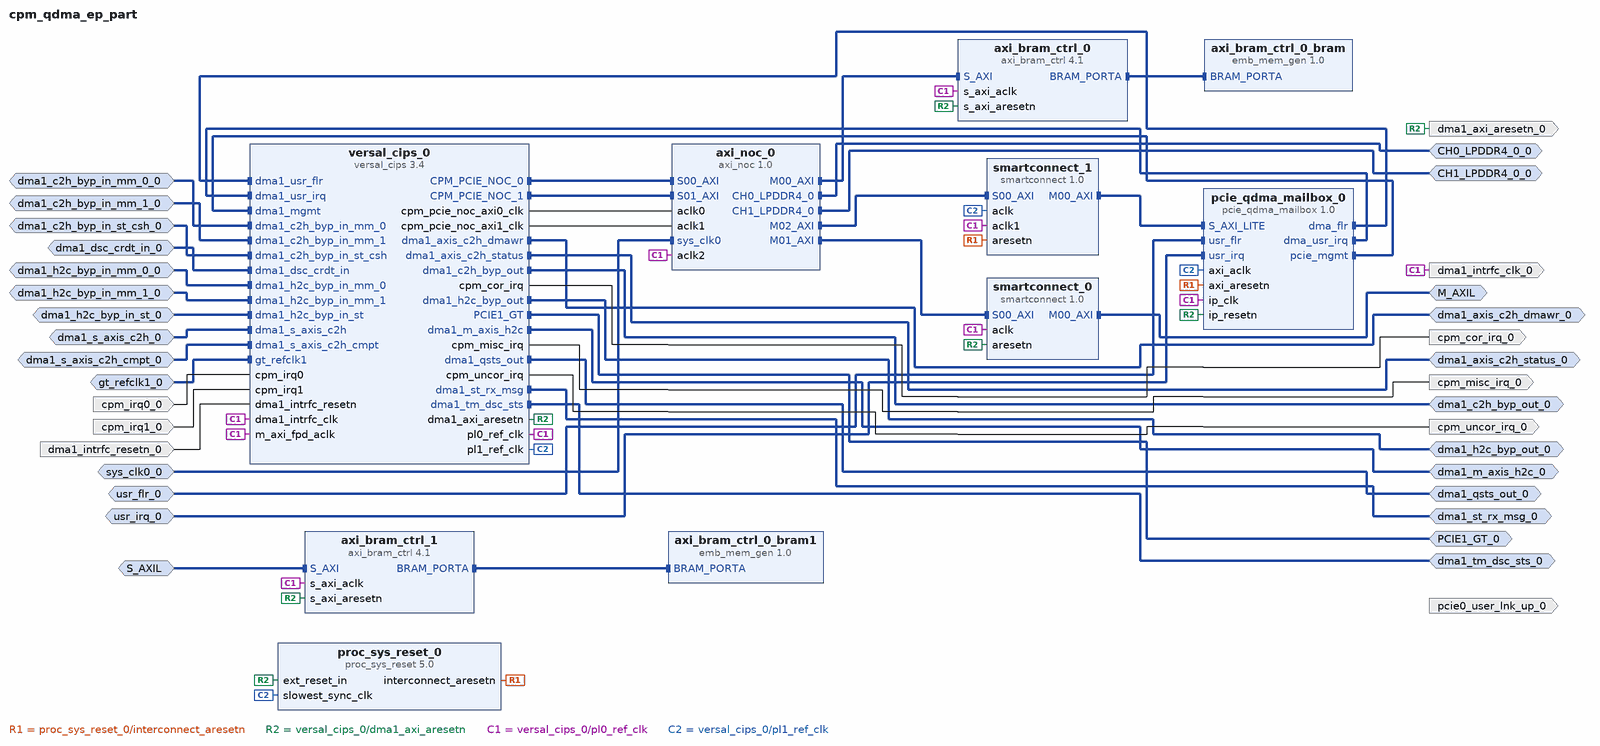
[diagram p0: block diagram of the top level]
# Vivado block design cpm_qdma_ep_part, xcvp1202-vsva2785-3HP-e-S, Vivado 2023.2
create_bd_design cpm_qdma_ep_part

create_bd_intf_port -mode Master -vlnv xilinx.com:interface:lpddr4_rtl:1.0 CH0_LPDDR4_0_0
create_bd_intf_port -mode Master -vlnv xilinx.com:interface:lpddr4_rtl:1.0 CH1_LPDDR4_0_0
create_bd_intf_port -mode Master -vlnv xilinx.com:interface:aximm_rtl:1.0 M_AXIL
set_property -dict [list \
  CONFIG.ADDR_WIDTH 42 \
  CONFIG.DATA_WIDTH 32 \
  CONFIG.HAS_BURST 0 \
  CONFIG.HAS_CACHE 0 \
  CONFIG.HAS_LOCK 0 \
  CONFIG.HAS_PROT 1 \
  CONFIG.HAS_QOS 0 \
  CONFIG.HAS_REGION 0 \
  CONFIG.PROTOCOL AXI4LITE \
] [get_bd_intf_ports M_AXIL]
create_bd_intf_port -mode Master -vlnv xilinx.com:interface:gt_rtl:1.0 PCIE1_GT_0
create_bd_intf_port -mode Slave -vlnv xilinx.com:interface:aximm_rtl:1.0 S_AXIL
set_property -dict [list \
  CONFIG.ADDR_WIDTH 15 \
  CONFIG.ARUSER_WIDTH 0 \
  CONFIG.AWUSER_WIDTH 0 \
  CONFIG.BUSER_WIDTH 0 \
  CONFIG.DATA_WIDTH 32 \
  CONFIG.HAS_BRESP 1 \
  CONFIG.HAS_BURST 0 \
  CONFIG.HAS_CACHE 0 \
  CONFIG.HAS_LOCK 0 \
  CONFIG.HAS_PROT 1 \
  CONFIG.HAS_QOS 0 \
  CONFIG.HAS_REGION 0 \
  CONFIG.HAS_RRESP 1 \
  CONFIG.HAS_WSTRB 1 \
  CONFIG.ID_WIDTH 0 \
  CONFIG.MAX_BURST_LENGTH 1 \
  CONFIG.NUM_READ_OUTSTANDING 1 \
  CONFIG.NUM_READ_THREADS 1 \
  CONFIG.NUM_WRITE_OUTSTANDING 1 \
  CONFIG.NUM_WRITE_THREADS 1 \
  CONFIG.PROTOCOL AXI4LITE \
  CONFIG.READ_WRITE_MODE READ_WRITE \
  CONFIG.RUSER_BITS_PER_BYTE 0 \
  CONFIG.RUSER_WIDTH 0 \
  CONFIG.SUPPORTS_NARROW_BURST 0 \
  CONFIG.WUSER_BITS_PER_BYTE 0 \
  CONFIG.WUSER_WIDTH 0 \
] [get_bd_intf_ports S_AXIL]
create_bd_intf_port -mode Master -vlnv xilinx.com:display_eqdma:axis_c2h_dmawr_rtl:1.0 dma1_axis_c2h_dmawr_0
create_bd_intf_port -mode Master -vlnv xilinx.com:interface:qdma_c2h_status_rtl:1.0 dma1_axis_c2h_status_0
create_bd_intf_port -mode Slave -vlnv xilinx.com:interface:qdma_dsc_byp_rtl:1.0 dma1_c2h_byp_in_mm_0_0
create_bd_intf_port -mode Slave -vlnv xilinx.com:interface:qdma_dsc_byp_rtl:1.0 dma1_c2h_byp_in_mm_1_0
create_bd_intf_port -mode Slave -vlnv xilinx.com:interface:qdma_dsc_byp_rtl:1.0 dma1_c2h_byp_in_st_csh_0
create_bd_intf_port -mode Master -vlnv xilinx.com:interface:qdma_dsc_byp_rtl:1.0 dma1_c2h_byp_out_0
create_bd_intf_port -mode Slave -vlnv xilinx.com:interface:qdma_dsc_crdt_in_rtl:1.0 dma1_dsc_crdt_in_0
create_bd_intf_port -mode Slave -vlnv xilinx.com:interface:qdma_dsc_byp_rtl:1.0 dma1_h2c_byp_in_mm_0_0
create_bd_intf_port -mode Slave -vlnv xilinx.com:interface:qdma_dsc_byp_rtl:1.0 dma1_h2c_byp_in_mm_1_0
create_bd_intf_port -mode Slave -vlnv xilinx.com:interface:qdma_dsc_byp_rtl:1.0 dma1_h2c_byp_in_st_0
create_bd_intf_port -mode Master -vlnv xilinx.com:interface:qdma_dsc_byp_rtl:1.0 dma1_h2c_byp_out_0
create_bd_intf_port -mode Master -vlnv xilinx.com:display_eqdma:m_axis_h2c_rtl:1.0 dma1_m_axis_h2c_0
create_bd_intf_port -mode Master -vlnv xilinx.com:interface:eqdma_qsts_rtl:1.0 dma1_qsts_out_0
create_bd_intf_port -mode Slave -vlnv xilinx.com:display_eqdma:s_axis_c2h_rtl:1.0 dma1_s_axis_c2h_0
create_bd_intf_port -mode Slave -vlnv xilinx.com:display_eqdma:s_axis_c2h_cmpt_rtl:1.0 dma1_s_axis_c2h_cmpt_0
create_bd_intf_port -mode Master -vlnv xilinx.com:interface:axis_rtl:1.0 dma1_st_rx_msg_0
create_bd_intf_port -mode Master -vlnv xilinx.com:interface:qdma_tm_dsc_sts_rtl:1.0 dma1_tm_dsc_sts_0
create_bd_intf_port -mode Slave -vlnv xilinx.com:interface:diff_clock_rtl:1.0 gt_refclk1_0
create_bd_intf_port -mode Slave -vlnv xilinx.com:interface:diff_clock_rtl:1.0 sys_clk0_0
set_property -dict {CONFIG.FREQ_HZ 200000000} [get_bd_intf_ports sys_clk0_0]
create_bd_intf_port -mode Slave -vlnv xilinx.com:interface:qdma_usr_irq_rtl:1.0 usr_irq_0
create_bd_intf_port -mode Slave -vlnv xilinx.com:display_eqdma:usr_flr_rtl:1.0 usr_flr_0
create_bd_port -dir O -type intr cpm_cor_irq_0
create_bd_port -dir I -type intr cpm_irq0_0
create_bd_port -dir I -type intr cpm_irq1_0
create_bd_port -dir O -type intr cpm_misc_irq_0
create_bd_port -dir O -type intr cpm_uncor_irq_0
create_bd_port -dir O -type rst dma1_axi_aresetn_0
create_bd_port -dir O -type clk dma1_intrfc_clk_0
set_property -dict [list \
  CONFIG.ASSOCIATED_BUSIF S_AXIL:M_AXIL:dma1_st_rx_msg_0 \
  CONFIG.ASSOCIATED_RESET dma1_axi_aresetn_0 \
] [get_bd_ports dma1_intrfc_clk_0]
create_bd_port -dir I -type rst dma1_intrfc_resetn_0
create_bd_port -dir O pcie0_user_lnk_up_0

create_bd_cell -type ip -vlnv xilinx.com:ip:axi_bram_ctrl:4.1 axi_bram_ctrl_0
set_property -dict {CONFIG.DATA_WIDTH 512 CONFIG.SINGLE_PORT_BRAM 1} [get_bd_cells axi_bram_ctrl_0]
create_bd_cell -type ip -vlnv xilinx.com:ip:emb_mem_gen:1.0 axi_bram_ctrl_0_bram1
set_property -dict {CONFIG.ADDR_WIDTH_A 12 CONFIG.ADDR_WIDTH_B 12} [get_bd_cells axi_bram_ctrl_0_bram1]
create_bd_cell -type ip -vlnv xilinx.com:ip:emb_mem_gen:1.0 axi_bram_ctrl_0_bram
set_property -dict [list \
  CONFIG.ADDR_WIDTH_A 12 \
  CONFIG.ADDR_WIDTH_B 12 \
  CONFIG.READ_DATA_WIDTH_B 512 \
  CONFIG.WRITE_DATA_WIDTH_B 512 \
] [get_bd_cells axi_bram_ctrl_0_bram]
create_bd_cell -type ip -vlnv xilinx.com:ip:axi_bram_ctrl:4.1 axi_bram_ctrl_1
set_property -dict {CONFIG.PROTOCOL AXI4LITE CONFIG.SINGLE_PORT_BRAM 1} [get_bd_cells axi_bram_ctrl_1]
create_bd_cell -type ip -vlnv xilinx.com:ip:axi_noc:1.0 axi_noc_0
set_property -dict [list \
  CONFIG.CONTROLLERTYPE LPDDR4_SDRAM \
  CONFIG.MC0_CONFIG_NUM config26 \
  CONFIG.MC0_FLIPPED_PINOUT true \
  CONFIG.MC1_CONFIG_NUM config26 \
  CONFIG.MC2_CONFIG_NUM config26 \
  CONFIG.MC3_CONFIG_NUM config26 \
  CONFIG.MC_ADDR_WIDTH 6 \
  CONFIG.MC_BURST_LENGTH 16 \
  CONFIG.MC_CASLATENCY 28 \
  CONFIG.MC_CASWRITELATENCY 14 \
  CONFIG.MC_CH0_LP4_CHA_ENABLE true \
  CONFIG.MC_CH0_LP4_CHB_ENABLE true \
  CONFIG.MC_CH1_LP4_CHA_ENABLE true \
  CONFIG.MC_CH1_LP4_CHB_ENABLE true \
  CONFIG.MC_CHAN_REGION1 DDR_LOW1 \
  CONFIG.MC_CKE_WIDTH 0 \
  CONFIG.MC_CK_WIDTH 0 \
  CONFIG.MC_COMPONENT_DENSITY 16Gb \
  CONFIG.MC_COMPONENT_WIDTH x32 \
  CONFIG.MC_CONFIG_NUM config26 \
  CONFIG.MC_DATAWIDTH 32 \
  CONFIG.MC_DM_WIDTH 4 \
  CONFIG.MC_DQS_WIDTH 4 \
  CONFIG.MC_DQ_WIDTH 32 \
  CONFIG.MC_ECC false \
  CONFIG.MC_ECC_SCRUB_SIZE 4096 \
  CONFIG.MC_F1_CASLATENCY 28 \
  CONFIG.MC_F1_CASWRITELATENCY 14 \
  CONFIG.MC_F1_LPDDR4_MR1 0x0000 \
  CONFIG.MC_F1_LPDDR4_MR2 0x0000 \
  CONFIG.MC_F1_LPDDR4_MR3 0x0000 \
  CONFIG.MC_F1_LPDDR4_MR11 0x0000 \
  CONFIG.MC_F1_LPDDR4_MR13 0x00C0 \
  CONFIG.MC_F1_LPDDR4_MR22 0x0000 \
  CONFIG.MC_F1_TCCD_L 0 \
  CONFIG.MC_F1_TCCD_L_MIN 0 \
  CONFIG.MC_F1_TFAW 40000 \
  CONFIG.MC_F1_TFAWMIN 40000 \
  CONFIG.MC_F1_TMOD 0 \
  CONFIG.MC_F1_TMOD_MIN 0 \
  CONFIG.MC_F1_TMRD 14000 \
  CONFIG.MC_F1_TMRDMIN 14000 \
  CONFIG.MC_F1_TMRW 10000 \
  CONFIG.MC_F1_TMRWMIN 10000 \
  CONFIG.MC_F1_TRAS 42000 \
  CONFIG.MC_F1_TRASMIN 42000 \
  CONFIG.MC_F1_TRCD 18000 \
  CONFIG.MC_F1_TRCDMIN 18000 \
  CONFIG.MC_F1_TRPAB 21000 \
  CONFIG.MC_F1_TRPABMIN 21000 \
  CONFIG.MC_F1_TRPPB 18000 \
  CONFIG.MC_F1_TRPPBMIN 18000 \
  CONFIG.MC_F1_TRRD 10000 \
  CONFIG.MC_F1_TRRDMIN 10000 \
  CONFIG.MC_F1_TRRD_L 0 \
  CONFIG.MC_F1_TRRD_L_MIN 0 \
  CONFIG.MC_F1_TRRD_S 0 \
  CONFIG.MC_F1_TRRD_S_MIN 0 \
  CONFIG.MC_F1_TWR 18000 \
  CONFIG.MC_F1_TWRMIN 18000 \
  CONFIG.MC_F1_TWTR 10000 \
  CONFIG.MC_F1_TWTRMIN 10000 \
  CONFIG.MC_F1_TWTR_L 0 \
  CONFIG.MC_F1_TWTR_L_MIN 0 \
  CONFIG.MC_F1_TWTR_S 0 \
  CONFIG.MC_F1_TWTR_S_MIN 0 \
  CONFIG.MC_F1_TZQLAT 30000 \
  CONFIG.MC_F1_TZQLATMIN 30000 \
  CONFIG.MC_INPUTCLK0_PERIOD 5000 \
  CONFIG.MC_LP4_CA_A_WIDTH 6 \
  CONFIG.MC_LP4_CA_B_WIDTH 6 \
  CONFIG.MC_LP4_CKE_A_WIDTH 1 \
  CONFIG.MC_LP4_CKE_B_WIDTH 1 \
  CONFIG.MC_LP4_CKT_A_WIDTH 1 \
  CONFIG.MC_LP4_CKT_B_WIDTH 1 \
  CONFIG.MC_LP4_CS_A_WIDTH 1 \
  CONFIG.MC_LP4_CS_B_WIDTH 1 \
  CONFIG.MC_LP4_DMI_A_WIDTH 2 \
  CONFIG.MC_LP4_DMI_B_WIDTH 2 \
  CONFIG.MC_LP4_DQS_A_WIDTH 2 \
  CONFIG.MC_LP4_DQS_B_WIDTH 2 \
  CONFIG.MC_LP4_DQ_A_WIDTH 16 \
  CONFIG.MC_LP4_DQ_B_WIDTH 16 \
  CONFIG.MC_LP4_RESETN_WIDTH 1 \
  CONFIG.MC_MEMORY_SPEEDGRADE LPDDR4X-3200 \
  CONFIG.MC_MEMORY_TIMEPERIOD0 625 \
  CONFIG.MC_NETLIST_SIMULATION true \
  CONFIG.MC_NO_CHANNELS Dual \
  CONFIG.MC_ODTLon 6 \
  CONFIG.MC_ODT_WIDTH 0 \
  CONFIG.MC_PER_RD_INTVL 0 \
  CONFIG.MC_PRE_DEF_ADDR_MAP_SEL ROW_BANK_COLUMN \
  CONFIG.MC_TCCD 8 \
  CONFIG.MC_TCCD_L 0 \
  CONFIG.MC_TCCD_L_MIN 0 \
  CONFIG.MC_TCKE 12 \
  CONFIG.MC_TCKEMIN 12 \
  CONFIG.MC_TDQS2DQ_MAX 800 \
  CONFIG.MC_TDQS2DQ_MIN 200 \
  CONFIG.MC_TDQSCK_MAX 3500 \
  CONFIG.MC_TFAW 40000 \
  CONFIG.MC_TFAWMIN 40000 \
  CONFIG.MC_TMOD 0 \
  CONFIG.MC_TMOD_MIN 0 \
  CONFIG.MC_TMRD 14000 \
  CONFIG.MC_TMRDMIN 14000 \
  CONFIG.MC_TMRD_div4 10 \
  CONFIG.MC_TMRD_nCK 23 \
  CONFIG.MC_TMRW 10000 \
  CONFIG.MC_TMRWMIN 10000 \
  CONFIG.MC_TMRW_div4 10 \
  CONFIG.MC_TMRW_nCK 16 \
  CONFIG.MC_TODTon_MIN 3 \
  CONFIG.MC_TOSCO 40000 \
  CONFIG.MC_TOSCOMIN 40000 \
  CONFIG.MC_TOSCO_nCK 64 \
  CONFIG.MC_TPBR2PBR 90000 \
  CONFIG.MC_TPBR2PBRMIN 90000 \
  CONFIG.MC_TRAS 42000 \
  CONFIG.MC_TRASMIN 42000 \
  CONFIG.MC_TRAS_nCK 68 \
  CONFIG.MC_TRC 63000 \
  CONFIG.MC_TRCD 18000 \
  CONFIG.MC_TRCDMIN 18000 \
  CONFIG.MC_TRCD_nCK 29 \
  CONFIG.MC_TRCMIN 0 \
  CONFIG.MC_TREFI 3904000 \
  CONFIG.MC_TREFIPB 488000 \
  CONFIG.MC_TRFC 0 \
  CONFIG.MC_TRFCAB 280000 \
  CONFIG.MC_TRFCABMIN 280000 \
  CONFIG.MC_TRFCMIN 0 \
  CONFIG.MC_TRFCPB 140000 \
  CONFIG.MC_TRFCPBMIN 140000 \
  CONFIG.MC_TRP 0 \
  CONFIG.MC_TRPAB 21000 \
  CONFIG.MC_TRPABMIN 21000 \
  CONFIG.MC_TRPAB_nCK 34 \
  CONFIG.MC_TRPMIN 0 \
  CONFIG.MC_TRPPB 18000 \
  CONFIG.MC_TRPPBMIN 18000 \
  CONFIG.MC_TRPPB_nCK 29 \
  CONFIG.MC_TRPRE 1.8 \
  CONFIG.MC_TRRD 10000 \
  CONFIG.MC_TRRDMIN 10000 \
  CONFIG.MC_TRRD_L 0 \
  CONFIG.MC_TRRD_L_MIN 0 \
  CONFIG.MC_TRRD_S 0 \
  CONFIG.MC_TRRD_S_MIN 0 \
  CONFIG.MC_TRRD_nCK 16 \
  CONFIG.MC_TWPRE 1.8 \
  CONFIG.MC_TWPST 0.4 \
  CONFIG.MC_TWR 18000 \
  CONFIG.MC_TWRMIN 18000 \
  CONFIG.MC_TWR_nCK 29 \
  CONFIG.MC_TWTR 10000 \
  CONFIG.MC_TWTRMIN 10000 \
  CONFIG.MC_TWTR_L 0 \
  CONFIG.MC_TWTR_S 0 \
  CONFIG.MC_TWTR_S_MIN 0 \
  CONFIG.MC_TWTR_nCK 16 \
  CONFIG.MC_TXP 12 \
  CONFIG.MC_TXPMIN 12 \
  CONFIG.MC_TXPR 0 \
  CONFIG.MC_TZQCAL 1000000 \
  CONFIG.MC_TZQCAL_div4 400 \
  CONFIG.MC_TZQCS_ITVL 0 \
  CONFIG.MC_TZQLAT 30000 \
  CONFIG.MC_TZQLATMIN 30000 \
  CONFIG.MC_TZQLAT_div4 12 \
  CONFIG.MC_TZQLAT_nCK 48 \
  CONFIG.MC_TZQ_START_ITVL 1000000000 \
  CONFIG.MC_USER_DEFINED_ADDRESS_MAP 16RA-3BA-10CA \
  CONFIG.MC_XPLL_CLKOUT1_PERIOD 1250 \
  CONFIG.NUM_CLKS 3 \
  CONFIG.NUM_MC 1 \
  CONFIG.NUM_MCP 4 \
  CONFIG.NUM_MI 3 \
  CONFIG.NUM_NMI 0 \
  CONFIG.NUM_SI 2 \
] [get_bd_cells axi_noc_0]
create_bd_cell -type ip -vlnv xilinx.com:ip:smartconnect:1.0 smartconnect_0
set_property -dict {CONFIG.NUM_CLKS 1 CONFIG.NUM_MI 1 CONFIG.NUM_SI 1} [get_bd_cells smartconnect_0]
create_bd_cell -type ip -vlnv xilinx.com:ip:smartconnect:1.0 smartconnect_1
set_property -dict {CONFIG.NUM_CLKS 2 CONFIG.NUM_SI 1} [get_bd_cells smartconnect_1]
create_bd_cell -type ip -vlnv xilinx.com:ip:proc_sys_reset:5.0 proc_sys_reset_0
set_property -dict {CONFIG.C_EXT_RST_WIDTH 4 CONFIG.C_NUM_INTERCONNECT_ARESETN 1} [get_bd_cells proc_sys_reset_0]
create_bd_cell -type ip -vlnv xilinx.com:ip:versal_cips:3.4 versal_cips_0
